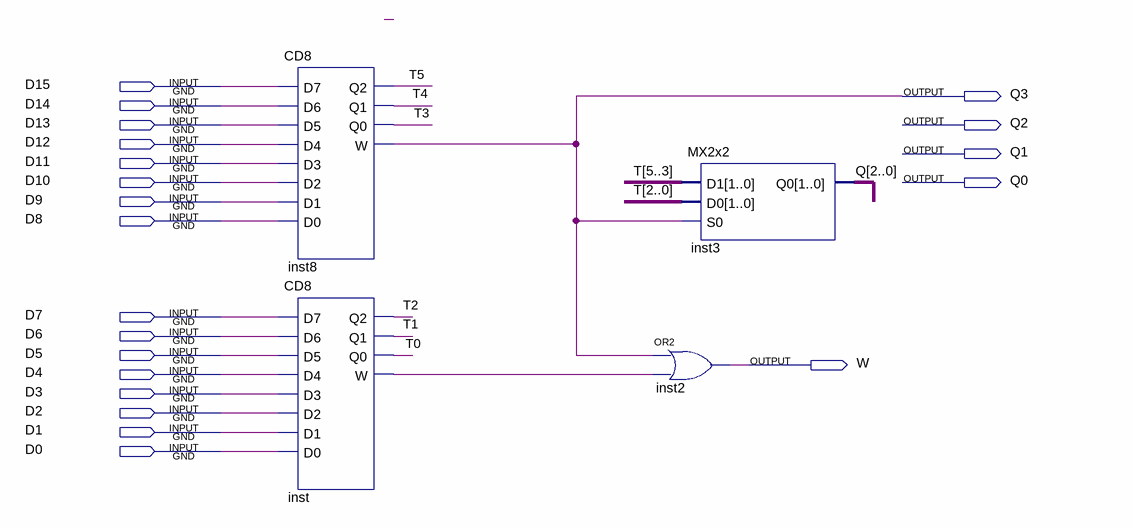
[diagram p0: schematic sheet]
// Quartus schematic CD16.bdf as structural Verilog: 4 symbols, 21 pins
module CD16 (
  input  D15,
  input  D14,
  input  D13,
  input  D12,
  input  D11,
  input  D10,
  input  D9,
  input  D8,
  input  D7,
  input  D6,
  input  D5,
  input  D4,
  input  D3,
  input  D2,
  input  D1,
  input  D0,
  output Q3,
  output Q2,
  output Q1,
  output Q0,
  output W
);

  wire inst_w;
  wire [5:0] T;

  CD8 inst8 (
    .D7(D15), .D6(D14), .D5(D13), .D4(D12), .D3(D11), .D2(D10), .D1(D9), .D0(D8), .Q2(T[5]), .Q1(T[4]),
    .Q0(T[3]), .W(Q3));
  CD8 inst (
    .D7(D7), .D6(D6), .D5(D5), .D4(D4), .D3(D3), .D2(D2), .D1(D1), .D0(D0), .Q2(T[2]), .Q1(T[1]), .Q0(T[0]),
    .W(inst_w));
  MX2x2 inst3 (.D1(T[5:3]), .D0(T[2:0]), .S0(Q3), .Q0({Q2, Q1, Q0}));
  or inst2 (W, Q3, inst_w);
endmodule
